# Altium schematic sheet TH8_AFE.SchDoc: Sensor
size 420 x 297 mm; Author: G.Kasprowicz; CompanyName: WUT ISE; DrawnBy: G.Kasprowicz; Organization: WUT ISE; Address1: PW ISE; Address2: Nowowiejska 15/19 00-665 Warsaw; Address3: gkasprow@gmail.com; DocumentNumber: 2; Revision: 1.0; SheetNumber: 2; SheetTotal: 9; ModifiedBy: -; CheckedDate: -; Title2: ADC; DivGrp: WUT ISE; Designer: G.Kasprowicz; ModifiedDate: -; ProjectName: Sensor Box
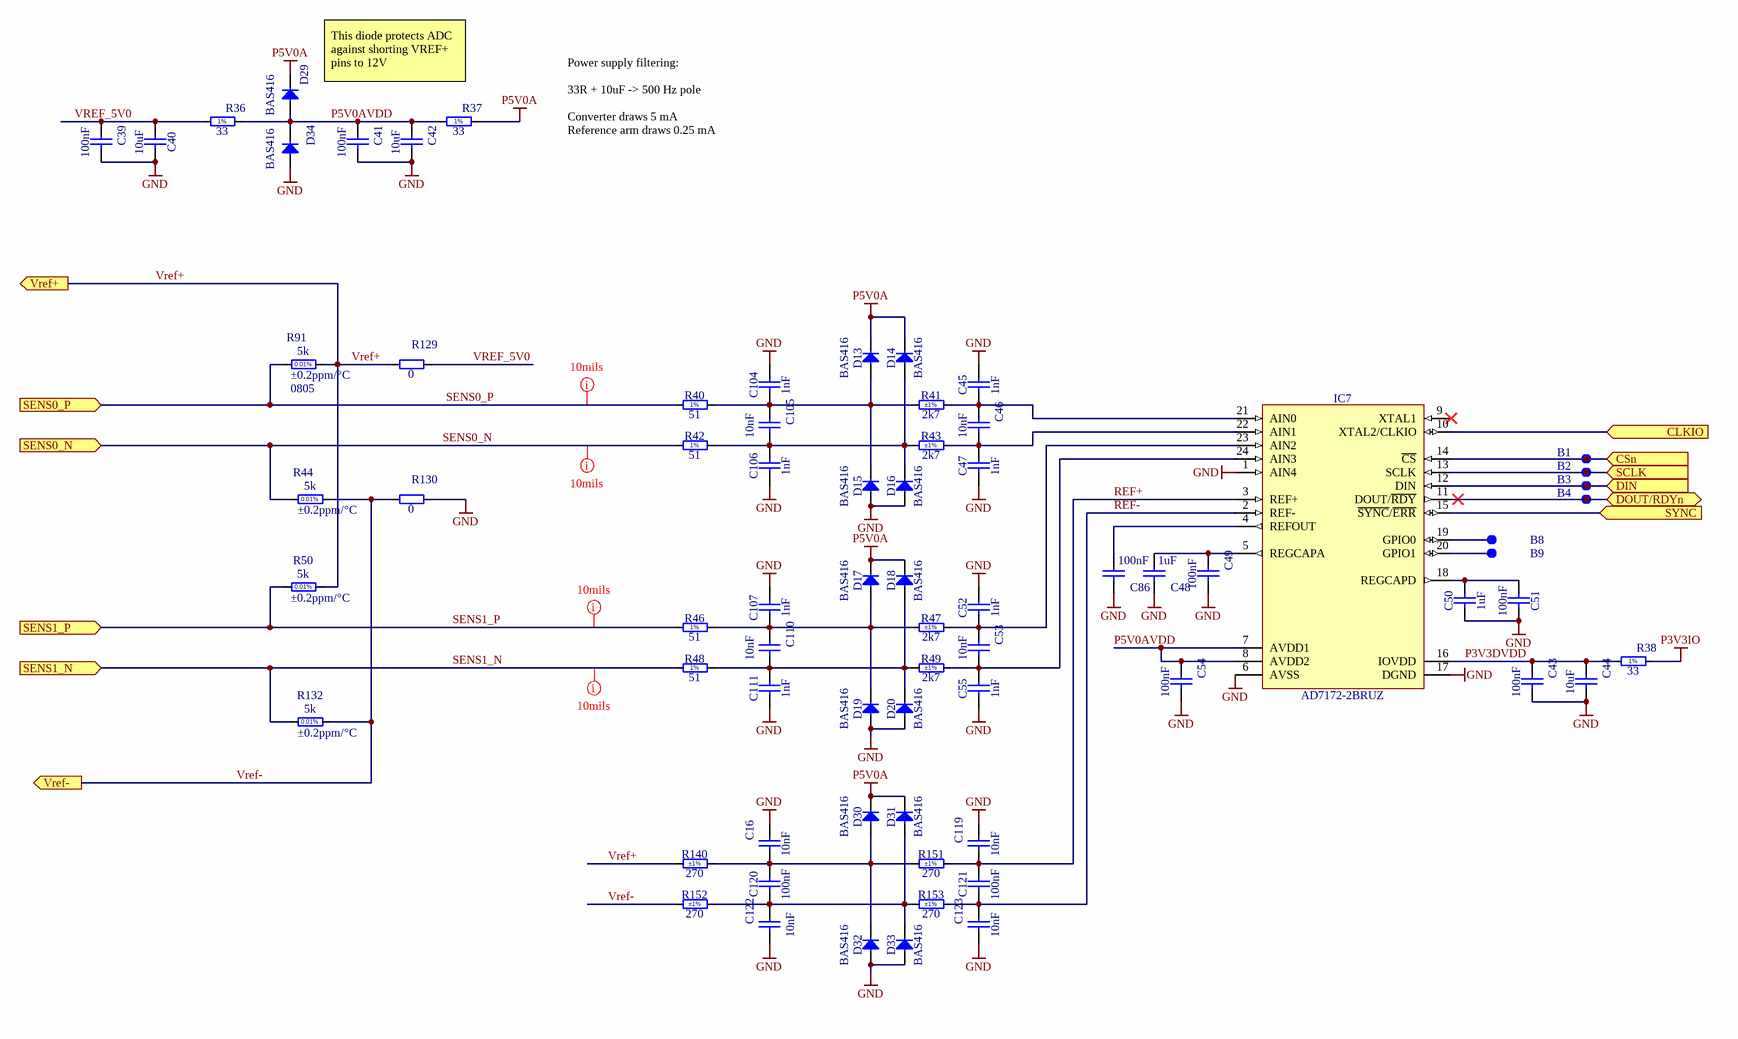
[diagram p0: TH8_AFE.SchDoc]

## Parts
B1  SMD Pad  [C100]  (value not drawn)
B2  SMD Pad  [C100]  (value not drawn)
B3  SMD Pad  [C100]  (value not drawn)
B4  SMD Pad  [C100]  (value not drawn)
B8  SMD Pad  [C100]  (value not drawn)
B9  SMD Pad  [C100]  (value not drawn)
C16  10nF  [CAPC1608X87N]
C39  100nF  [CAPC1005X55N]
C40  10uF  [CAPC2012X135N]
C41  100nF  [CAPC1005X55N]
C42  10uF  [CAPC2012X135N]
C43  100nF  [CAPC1005X55N]
C44  10uF  [CAPC2012X135N]
C45  1nF  [CAPC1608X90N]
C46  10nF  [CAPC1608X87N]
C47  1nF  [CAPC1608X90N]
C48  1uF  [CAPC1608X87N]
C49  100nF  [CAPC1005X55N]
C50  1uF  [CAPC1608X87N]
C51  100nF  [CAPC1005X55N]
C52  1nF  [CAPC1608X90N]
C53  10nF  [CAPC1608X87N]
C54  100nF  [CAPC1005X55N]
C55  1nF  [CAPC1608X90N]
C86  100nF  [CAPC1005X55N]
C104  1nF  [CAPC1608X90N]
C105  10nF  [CAPC1608X87N]
C106  1nF  [CAPC1608X90N]
C107  1nF  [CAPC1608X90N]
C110  10nF  [CAPC1608X87N]
C111  1nF  [CAPC1608X90N]
C119  10nF  [CAPC1608X87N]
C120  100nF  [CAPC1608X87N]
C121  100nF  [CAPC1608X87N]
C122  10nF  [CAPC1608X87N]
C123  10nF  [CAPC1608X87N]
D13  BAS416  [SOD2512X110N]
D14  BAS416  [SOD2512X110N]
D15  BAS416  [SOD2512X110N]
D16  BAS416  [SOD2512X110N]
D17  BAS416  [SOD2512X110N]
D18  BAS416  [SOD2512X110N]
D19  BAS416  [SOD2512X110N]
D20  BAS416  [SOD2512X110N]
D29  BAS416  [SOD2512X110N]
D30  BAS416  [SOD2512X110N]
D31  BAS416  [SOD2512X110N]
D32  BAS416  [SOD2512X110N]
D33  BAS416  [SOD2512X110N]
D34  BAS416  [SOD2512X110N]
IC7  AD7172-2BRUZ  [SOP65P640X120-24N]
R36  33  [RESC1005X40N]
R37  33  [RESC1005X40N]
R38  33  [RESC1005X40N]
R40  51  [RESC1005X40N]
R41  2k7  Tolerance: ±1%  [RESC1005X40N]
R42  51  [RESC1005X40N]
R43  2k7  Tolerance: ±1%  [RESC1005X40N]
R44  5k  TC: ±0.2ppm/°C  [RESC2013X64N]
R46  51  [RESC1005X40N]
R47  2k7  Tolerance: ±1%  [RESC1005X40N]
R48  51  [RESC1005X40N]
R49  2k7  Tolerance: ±1%  [RESC1005X40N]
R50  5k  TC: ±0.2ppm/°C  [RESC2013X64N]
R91  5k  TC: ±0.2ppm/°C  Case: 0805  [RESC2013X64N]
R129  0  [RESC1608X55N]
R130  0  [RESC1608X55N]
R132  5k  TC: ±0.2ppm/°C  [RESC2013X64N]
R140  270  Tolerance: ±1%  [RESC1005X40N]
R151  270  Tolerance: ±1%  [RESC1005X40N]
R152  270  Tolerance: ±1%  [RESC1005X40N]
R153  270  Tolerance: ±1%  [RESC1005X40N]

## Ports
CLKIO (in), CSn (in), DIN (in), DOUT/RDYn (bidir), SCLK (in), SENS0_N (in), SENS0_P (in), SENS1_N (in), SENS1_P (in), SYNC (in), Vref+ (out), Vref- (out)

## Nets
GND: C16.2 C39.2 C40.2 C41.2 C42.2 C43.2 C44.2 C45.2 C47.1 C48.1 C49.2 C50.1 C51.2 C52.2 C54.2 C55.1 C86.2 C104.2 C106.1 C107.2 C111.1 C119.2 C122.1 C123.1 D15.2(A) D16.2(A) D19.2(A) D20.2(A) D32.2(A) D33.2(A) D34.2(A) IC7.1(AIN4) IC7.6(AVSS) IC7.17(DGND) R130.2
P3V3IO: R38.2
P5V0A: D13.1(C) D14.1(C) D17.1(C) D18.1(C) D29.1(C) D30.1(C) D31.1(C) R37.2
CLKIO: IC7.10(XTAL2/CLKIO) ; port CLKIO
CSn: B1.1 IC7.14(~{CS}) ; port CSn
DIN: B3.1 IC7.12(DIN) ; port DIN
DOUT/RDYn: B4.1 IC7.11(DOUT/~{RDY}) ; port DOUT/RDYn
P3V3DVDD: C43.1 C44.1 IC7.16(IOVDD) R38.1
P5V0AVDD: C41.1 C42.1 C54.1 D29.2(A) D34.1(C) IC7.7(AVDD1) IC7.8(AVDD2) R36.2 R37.1
REF+: C119.1 C121.2 IC7.3(REF+) R151.2
REF-: C121.1 C123.2 IC7.2(REF-) R153.2
SCLK: B2.1 IC7.13(SCLK) ; port SCLK
SENS0_N: R42.1 R44.1 ; port SENS0_N
SENS0_P: R40.1 R91.1 ; port SENS0_P
SENS1_N: R48.1 R132.1 ; port SENS1_N
SENS1_P: R46.1 R50.1 ; port SENS1_P
SYNC: IC7.15(~{SYNC}/~{ERR}) ; port SYNC
Vref+: R50.2 R91.2 R129.1 R140.1 ; port Vref+
Vref-: R44.2 R130.1 R132.2 R152.1 ; port Vref-
VREF_5V0: C39.1 C40.1 R36.1 R129.2
NetB8_1: B8.1 IC7.19(GPIO0)
NetB9_1: B9.1 IC7.20(GPIO1)
NetC16_1: C16.1 C120.2 D30.2(A) D32.1(C) R140.2 R151.1
NetC45_1: C45.1 C46.1 IC7.21(AIN0) R41.2
NetC46_2: C46.2 C47.2 IC7.22(AIN1) R43.2
NetC48_2: C48.2 C49.1 IC7.5(REGCAPA)
NetC50_2: C50.2 C51.1 IC7.18(REGCAPD)
NetC52_1: C52.1 C53.1 IC7.23(AIN2) R47.2
NetC53_2: C53.2 C55.2 IC7.24(AIN3) R49.2
NetC86_1: C86.1 IC7.4(REFOUT)
NetC104_1: C104.1 C105.1 D13.2(A) D15.1(C) R40.2 R41.1
NetC105_2: C105.2 C106.2 D14.2(A) D16.1(C) R42.2 R43.1
NetC107_1: C107.1 C110.1 D17.2(A) D19.1(C) R46.2 R47.1
NetC110_2: C110.2 C111.2 D18.2(A) D20.1(C) R48.2 R49.1
NetC120_1: C120.1 C122.2 D31.2(A) D33.1(C) R152.2 R153.1

Not connected (* = marked no-connect by the designer): IC7 9(XTAL1)*

## Layout directives
rule Width Constraint [Pref Width = 10mil    Min Width = 10mil    Max Width = 15mil]: SENS0_N, SENS0_P, SENS1_N, SENS1_P

## Notes on the sheet
- This diode protects ADC against shorting VREF+ pins to 12V
- Power supply filtering:
  33R + 10uF -> 500 Hz pole
  Converter draws 5 mA
  Reference arm draws 0.25 mA
- Project/Equipment
- Document
- Designer
- Drawn by
- Check.by
- Copyright WUT ISE 2020.
  This documentation describes Open Hardware and is licensed under the CERN OHL v.1.2. You may redistribute and modify this documentation under the terms of the CERN OHL v.1.2. (http://ohwr.org/CERNOHL). This documentation is distributed WITHOUT ANY EXPRESS OR IMPLIED WARRANTY, INCLUDING OF MERCHANTABILITY, SATISFACTORY QUALITY AND FITNESS FOR A PARTICULAR PURPOSE. Please see the CERN OHL v.1.2 for applicable conditions.
- Contact
- File
- Last Mod.
- Print Date
- Sheet
- Size
- A3
- of
- Rev
- (in symbol R0402_33R_1%_0.0625W_100PPM) 1%
- (in symbol R0402_51R_1%_0.0625W_100PPM) 1%
- (in symbol R0805_5K_0.01%_0.2W_0.2PPM_VISHAY_VSMP) 0.01%

## Library data of the parts
B1-B4 B8 B9 = SMD_PAD_D1MM: Through Hole Pad; Part Description: 1mm Diameter SMD Pad; Mounted: No; Part Number: SMD_PAD_D1MM; Component Kind: Standard (No BOM); Component Type: Standard (No BOM); Pin Count: 1; Family: SMD Pad; Socket: No; SMD: No; Sense: No; Status: None; ComponentHeight: 0mm; HelpURL: Undefined; Author: CERN DEM JLC; CreateDate: 10.10.2017; LatestRevisionDate: 10.10.2017; PackageDescription: 1mm Diameter SMD Pad
C16 C46 C53 C105 C110 C119 C122 C123 = CC0603_10NF_50V_5%_C0G: Non-polarised capacitor; Part Description: SMD Multilayer Chip Ceramic Capacitor; Manufacturer: GENERIC; Manufacturer1 Part Number: C1608C0G1H103J080AA; Voltage: 50V; TC: C0G/NP0; Tolerance: ±5%; Part Number: CC0603_10NF_50V_5%_C0G; Component Kind: Standard; Component Type: Standard; Pin Count: 2; Value: 10nF; Status: Preferred; Manufacturer Part Number: CC0603_10NF_50V_5%_C0G; Case: 0603; Mounted: Yes; Socket: No; SMD: Yes; Sense: No; Manufacturer1 Example: TDK; Manufacturer1 ComponentHeight: 0.9mm; HelpURL: \\cern.ch\dfs\Applications\Altium\Datasheets\CC0603_C0G_TDK_C.pdf; Author: CERN DEM JLC
  C16 C119 C122 C123: CreateDate: 10/12/2014; LatestRevisionDate: 10/12/2014
  C46 C53 C105 C110: CreateDate: 10.12.2014; LatestRevisionDate: 10.12.2014
C39 C41 C43 C49 C51 C54 C86 = CC0402_100NF_16V_10%_X5R: Non-polarised capacitor; Part Description: SMD Multilayer Chip Ceramic Capacitor; Manufacturer: GENERIC; Manufacturer1 Part Number: GRM155R61C104KA88D; Voltage: 16V; TC: X5R; Tolerance: ±10%; Table: Capacitors SMD; Part Number: CC0402_100NF_16V_10%_X5R; Component Kind: Standard; Component Type: Standard; Pin Count: 2; Value: 100nF; Status: None; Manufacturer Part Number: CC0402_100NF_16V_10%_X5R; Case: 0402; Mounted: Yes; Socket: No; SMD: Yes; Manufacturer1 Example: MURATA; Manufacturer1 ComponentHeight: 0.55mm; HelpURL: \\cern.ch\dfs\Applications\Altium\Datasheets\CC0402_X5R_MURATA_GRM.pdf; Author: CERN DEM JLC; CreateDate: 2013-12-10; LatestRevisionDate: 2013-12-10
C40 C42 C44 = CC0805_10UF_16V_10%_X5R: Non-polarised capacitor; Part Description: SMD Multilayer Chip Ceramic Capacitor; Manufacturer: GENERIC; Manufacturer1 Part Number: C0805C106K4PAC; Voltage: 16V; TC: X5R; Tolerance: ±10%; Part Number: CC0805_10UF_16V_10%_X5R; Component Kind: Standard; Component Type: Standard; Pin Count: 2; Value: 10uF; Status: Preferred; Manufacturer Part Number: CC0805_10UF_16V_10%_X5R; Case: 0805; Mounted: Yes; Socket: No; SMD: Yes; Manufacturer1 Example: KEMET; Manufacturer1 ComponentHeight: 1.4mm; HelpURL: \\cern.ch\dfs\Applications\Altium\Datasheets\CC1206_X5R_KEMET.pdf; Author: CERN DEM JLC; CreateDate: 03.12.2007; LatestRevisionDate: 03.12.2007; Sense: No
C45 C47 C52 C55 C104 C106 C107 C111 = CC0603_1NF_50V_5%_NP0: Non-polarised capacitor; Part Description: SMD Multilayer Chip Ceramic Capacitor; Manufacturer: GENERIC; Manufacturer1 Part Number: CC0603JRNPO9BN102; Voltage: 50V; TC: C0G/NP0; Tolerance: ±5%; Part Number: CC0603_1NF_50V_5%_NP0; Component Kind: Standard; Component Type: Standard; Pin Count: 2; Value: 1nF; Status: Preferred; Manufacturer Part Number: CC0603_1NF_50V_5%_NP0; Case: 0603; Mounted: Yes; Socket: No; SMD: Yes; Sense: No; Manufacturer1 Example: YAGEO PHYCOMP; Manufacturer1 ComponentHeight: 0.9mm; HelpURL: \\cern.ch\dfs\Applications\Altium\Datasheets\CC0805_NP0_PHYCOMP_16VTO50V.pdf; Author: CERN DEM JLC; CreateDate: 22.10.2012; LatestRevisionDate: 22.10.2012
C48 C50 = CC0603_1UF_25V_10%_X7R: Non-polarised capacitor; Part Description: SMD Multilayer Chip Ceramic Capacitor; Manufacturer: GENERIC; Manufacturer1 Part Number: GRM188R71E105KA12D; Voltage: 25V; TC: X7R; Tolerance: ±10%; Part Number: CC0603_1UF_25V_10%_X7R; Component Kind: Standard; Component Type: Standard; Pin Count: 2; Value: 1uF; Status: None; Manufacturer Part Number: CC0603_1UF_25V_10%_X7R; Case: 0603; Mounted: Yes; Socket: No; SMD: Yes; Sense: No; Manufacturer1 Example: MURATA; Manufacturer1 ComponentHeight: 0.9mm; HelpURL: \\cern.ch\dfs\Applications\Altium\Datasheets\CC0603_X7R_MURATA.pdf; Author: CERN DEM JLC; CreateDate: 18/01/2011; LatestRevisionDate: 18/01/2011
C120 C121 = CC0603_100NF_50V_10%_X5R: Non-polarised capacitor; Part Description: SMD Multilayer Chip Ceramic Capacitor; Manufacturer: GENERIC; Manufacturer1 Part Number: C1608X5R1H104K080; Voltage: 50V; TC: X5R; Tolerance: ±10%; Part Number: CC0603_100NF_50V_10%_X5R; Component Kind: Standard; Component Type: Standard; Pin Count: 2; Value: 100nF; Status: None; Manufacturer Part Number: CC0603_100NF_50V_10%_X5R; Case: 0603; Mounted: Yes; Socket: No; SMD: Yes; Sense: No; Manufacturer1 Example: TDK; Manufacturer1 ComponentHeight: 0.9mm; HelpURL: \\cern.ch\dfs\Applications\Altium\Datasheets\CC0603_X5R_TDK_C.pdf; Author: CERN DEM MR; CreateDate: 08.01.2016; LatestRevisionDate: 08.01.2016
D13-D20 D29-D34 = BAS416: Diode; Part Description: Low-Leakage Diode; Manufacturer: NXP SEMICONDUCTORS; Voltage: 75V; Power: 200mA; PressFit: No; Bonding: No; Part Number: BAS416; Component Kind: Standard; Component Type: Standard; Device: BAS416; PackageDescription: Small Outline Diode (SOD-323), 1.70mm W X 1.25mm L X 1.10mm H body,  IPC Medium Density; Manufacturer Part Number: BAS416; Pin Count: 2; Case: SOD323; Mounted: Yes; Socket: No; SMD: Yes; Sense: No; ComponentHeight: 1.1mm; HelpURL: \\cern.ch\dfs\Applications\Altium\Datasheets\BAS416.pdf; Author: CERN DEM JLC; CreateDate: 01/10/2013; LatestRevisionDate: 01/10/2013
IC7 = ADC_AD7172-2: 32-Bit, 10 kSPS, Sigma-Delta ADC with 100 µs Settling and True Rail-to-Rail Buffers; Part Description: Low Power, 24-Bit, 31.25 kSPS, Sigma-DeltaADC with True Rail-to-Rail Buffers; Manufacturer: ANALOG DEVICES; PressFit: No; Bonding: No; Part Number: AD7172-2BRUZ; Component Kind: Standard; Component Type: Standard; Device: AD7172-2BRUZ; PackageDescription: SOP, 0.65mm Pitch; 24 Pin, 4.40mm W X 5.00mm L X 1.20mm H Body IPC Medium Density; Manufacturer Part Number: AD7172-2BRUZ; Pin Count: 24; Case: TSSOP24; Mounted: Yes; Socket: No; SMD: Yes; Sense: No; ComponentHeight: 1.2mm; Author: GK; HelpURL: \\cern.ch\dfs\Applications\Altium\Datasheets\AD7177-2BRUZ.pdf; CreateDate: 14/12/2017; LatestRevisionDate: 14/12/2017
R36-R38 = R0402_33R_1%_0.0625W_100PPM: Resistor - 1%; Part Description: General Purpose Thick Film Chip Resistor; Manufacturer: GENERIC; Manufacturer1 Part Number: 232270673309L; TC: ±100ppm/°C; PressFit: No; Part Number: R0402_33R_1%_0.0625W_100PPM; Component Kind: Standard; Component Type: Standard; Pin Count: 2; Value: 33; Status: Not Recommended; Power: 0.0625W; Tolerance: ±1%; Manufacturer Part Number: R0402_33R_1%_0.0625W_100PPM; Case: 0402; Mounted: Yes; Sense: No; Socket: No; SMD: Yes; Manufacturer1 Example: YAGEO PHYCOMP; Manufacturer1 ComponentHeight: 0.4mm; HelpURL: \\cern.ch\dfs\Applications\Altium\Datasheets\R0402_Phycomp_RC0402.pdf; Author: CERN DEM JLC; CreateDate: 03/12/2007; LatestRevisionDate: 17/10/2012
R40 R42 R46 R48 = R0402_51R_1%_0.0625W_100PPM: Resistor - 1%; Part Description: General Purpose Thick Film Chip Resistor; Manufacturer: GENERIC; Manufacturer1 Part Number: 232270675109L; TC: ±100ppm/°C; PressFit: No; Part Number: R0402_51R_1%_0.0625W_100PPM; Component Kind: Standard; Component Type: Standard; Pin Count: 2; Value: 51; Status: Not Recommended; Power: 0.0625W; Tolerance: ±1%; Manufacturer Part Number: R0402_51R_1%_0.0625W_100PPM; Case: 0402; Mounted: Yes; Sense: No; Socket: No; SMD: Yes; Manufacturer1 Example: YAGEO PHYCOMP; Manufacturer1 ComponentHeight: 0.4mm; HelpURL: \\cern.ch\dfs\Applications\Altium\Datasheets\R0402_Phycomp_RC0402.pdf; Author: CERN DEM JLC; CreateDate: 03/12/2007; LatestRevisionDate: 17/10/2012
R41 R43 R47 R49 = R0402_2K4_1%_0.0625W_100PPM: Resistor - 1%; Part Number: R0402_2K7_1%_0.0625W_100PPM; Part Description: General Purpose Thick Film Chip Resistor; Manufacturer: GENERIC; Manufacturer1 Part Number: 232270672702L; TC: ±100ppm/°C; PressFit: No; Component Kind: Standard; Component Type: Standard; Pin Count: 2; Value: 2k7; Status: Not Recommended; Power: 0.0625W; Manufacturer Part Number: R0402_2K7_1%_0.0625W_100PPM; Case: 0402; Mounted: Yes; Sense: No; Socket: No; SMD: Yes; Manufacturer1 Example: YAGEO PHYCOMP; Manufacturer1 ComponentHeight: 0.4mm; HelpURL: \\cern.ch\dfs\Applications\Altium\Datasheets\R0402_Phycomp_RC0402.pdf; Author: CERN DEM JLC; CreateDate: 03.12.2007; LatestRevisionDate: 17.10.2012
R44 R50 R91 R132 = R0805_5K_0.01%_0.2W_0.2PPM_VISHAY_VSMP: Resistor - 0.01%; Part Description: Ultra High Precision Foil Wraparound Surface Mount Chip Resistor; Manufacturer: VISHAY PRECISION; Manufacturer Part Number: Y16245K00000T9R; Power: 0.2W; PressFit: No; Part Number: R0805_5K_0.01%_0.2W_0.2PPM_VISHAY_VSMP; Component Kind: Standard; Component Type: Standard; Pin Count: 2; Value: 5k; Status: None; Tolerance: ±0.01%; Mounted: Yes; Sense: No; Socket: No; SMD: Yes; Manufacturer1 ComponentHeight: 0.64mm; HelpURL: \\cern.ch\dfs\Applications\Altium\Datasheets\R0805_VISHAY_VSMP.pdf; Author: CERN DEM JLC; CreateDate: 22.09.2011; LatestRevisionDate: 22.09.2011
  R44 R50 R132: Case: 0805
R129 R130 = R0603_0R_JUMPER: Resistor; Part Description: 1A (0.05R Max DC Resistance) Zero Ohm Jumper; Manufacturer: GENERIC; Manufacturer1 Part Number: NRC06Z0; PressFit: No; Part Number: R0603_0R_JUMPER; Component Kind: Standard; Component Type: Standard; Pin Count: 2; Value: 0; Status: Preferred; Manufacturer Part Number: R0603_0R_JUMPER; Case: 0603; Mounted: Yes; Sense: No; Socket: No; SMD: Yes; Manufacturer1 Example: NIC COMPONENT; Manufacturer1 ComponentHeight: 0.55mm; HelpURL: \\cern.ch\dfs\Applications\Altium\Datasheets\R0603_NIC_NRC.pdf; Author: CERN DEM JLC; CreateDate: 03.12.2007; LatestRevisionDate: 13.03.2008
R140 R151-R153 = R0402_270R_1%_0.0625W_100PPM: Resistor - 1%; Part Description: General Purpose Thick Film Chip Resistor; Manufacturer: GENERIC; Manufacturer1 Part Number: 232270672701L; TC: ±100ppm/°C; PressFit: No; Part Number: R0402_270R_1%_0.0625W_100PPM; Component Kind: Standard; Component Type: Standard; Pin Count: 2; Value: 270; Status: Not Recommended; Power: 0.0625W; Manufacturer Part Number: R0402_270R_1%_0.0625W_100PPM; Case: 0402; Mounted: Yes; Sense: No; Socket: No; SMD: Yes; Manufacturer1 Example: YAGEO PHYCOMP; Manufacturer1 ComponentHeight: 0.4mm; HelpURL: \\cern.ch\dfs\Applications\Altium\Datasheets\R0402_Phycomp_RC0402.pdf; Author: CERN DEM JLC; CreateDate: 03.12.2007; LatestRevisionDate: 17.10.2012